# Altium schematic sheet tussenprint.SchDoc
size A4; SheetNumber: 1; SheetTotal: 1
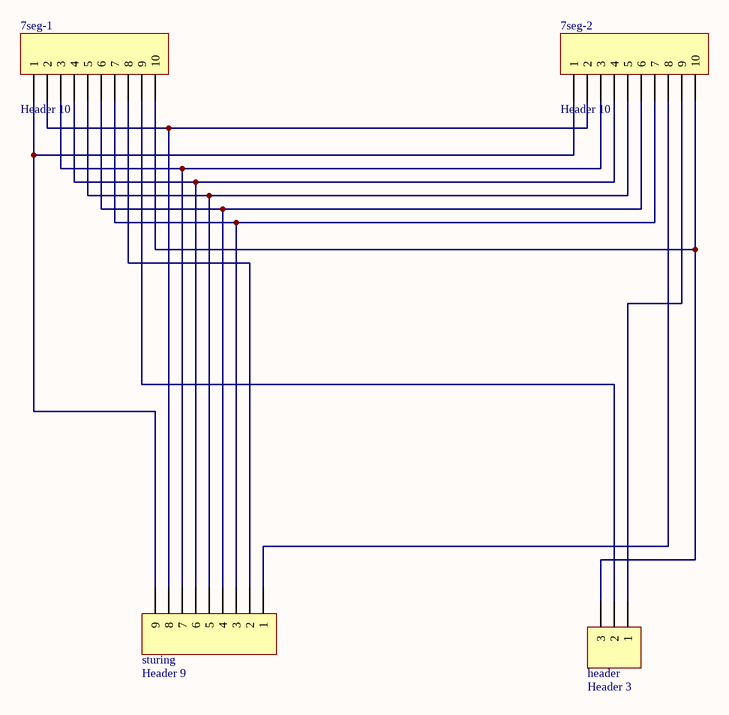
[diagram p0: tussenprint.SchDoc]

## Parts
7seg-1  Header 10  [HDR1X10]
7seg-2  Header 10  [HDR1X10]
header  Header 3  [HDR1X3]
sturing  Header 9  [HDR1X9]

## Nets
Net7seg-1_1: 7seg-1.1 7seg-2.1 sturing.9
Net7seg-1_2: 7seg-1.2 7seg-2.2 sturing.8
Net7seg-1_3: 7seg-1.3 7seg-2.3 sturing.7
Net7seg-1_4: 7seg-1.4 7seg-2.4 sturing.6
Net7seg-1_5: 7seg-1.5 7seg-2.5 sturing.5
Net7seg-1_6: 7seg-1.6 7seg-2.6 sturing.4
Net7seg-1_7: 7seg-1.7 7seg-2.7 sturing.3
Net7seg-1_8: 7seg-1.8 sturing.2
Net7seg-1_9: 7seg-1.9 header.2
Net7seg-1_10: 7seg-1.10 7seg-2.10 header.3
Net7seg-2_8: 7seg-2.8 sturing.1
Net7seg-2_9: 7seg-2.9 header.1

## Library data of the parts
7seg-1 7seg-2 = Header 10: Header, 10-Pin; LatestRevisionDate: 17-Jul-2002; LatestRevisionNote: Re-released for DXP Platform.; Publisher: Altium Limited
header = Header 3: Header, 3-Pin; LatestRevisionDate: 17-Jul-2002; LatestRevisionNote: Re-released for DXP Platform.; Publisher: Altium Limited
sturing = Header 9: Header, 9-Pin; LatestRevisionDate: 17-Jul-2002; LatestRevisionNote: Re-released for DXP Platform.; Publisher: Altium Limited